# Altium schematic sheet Sheet1_Ren.SchDoc
size 431 x 279 mm; DocumentNumber: 1; SheetNumber: 1; SheetTotal: 1; ENG_APP_DATE: --/--/--; DSN_APP_DATE: --/--/--; CHK_APP_DATE: --/--/--
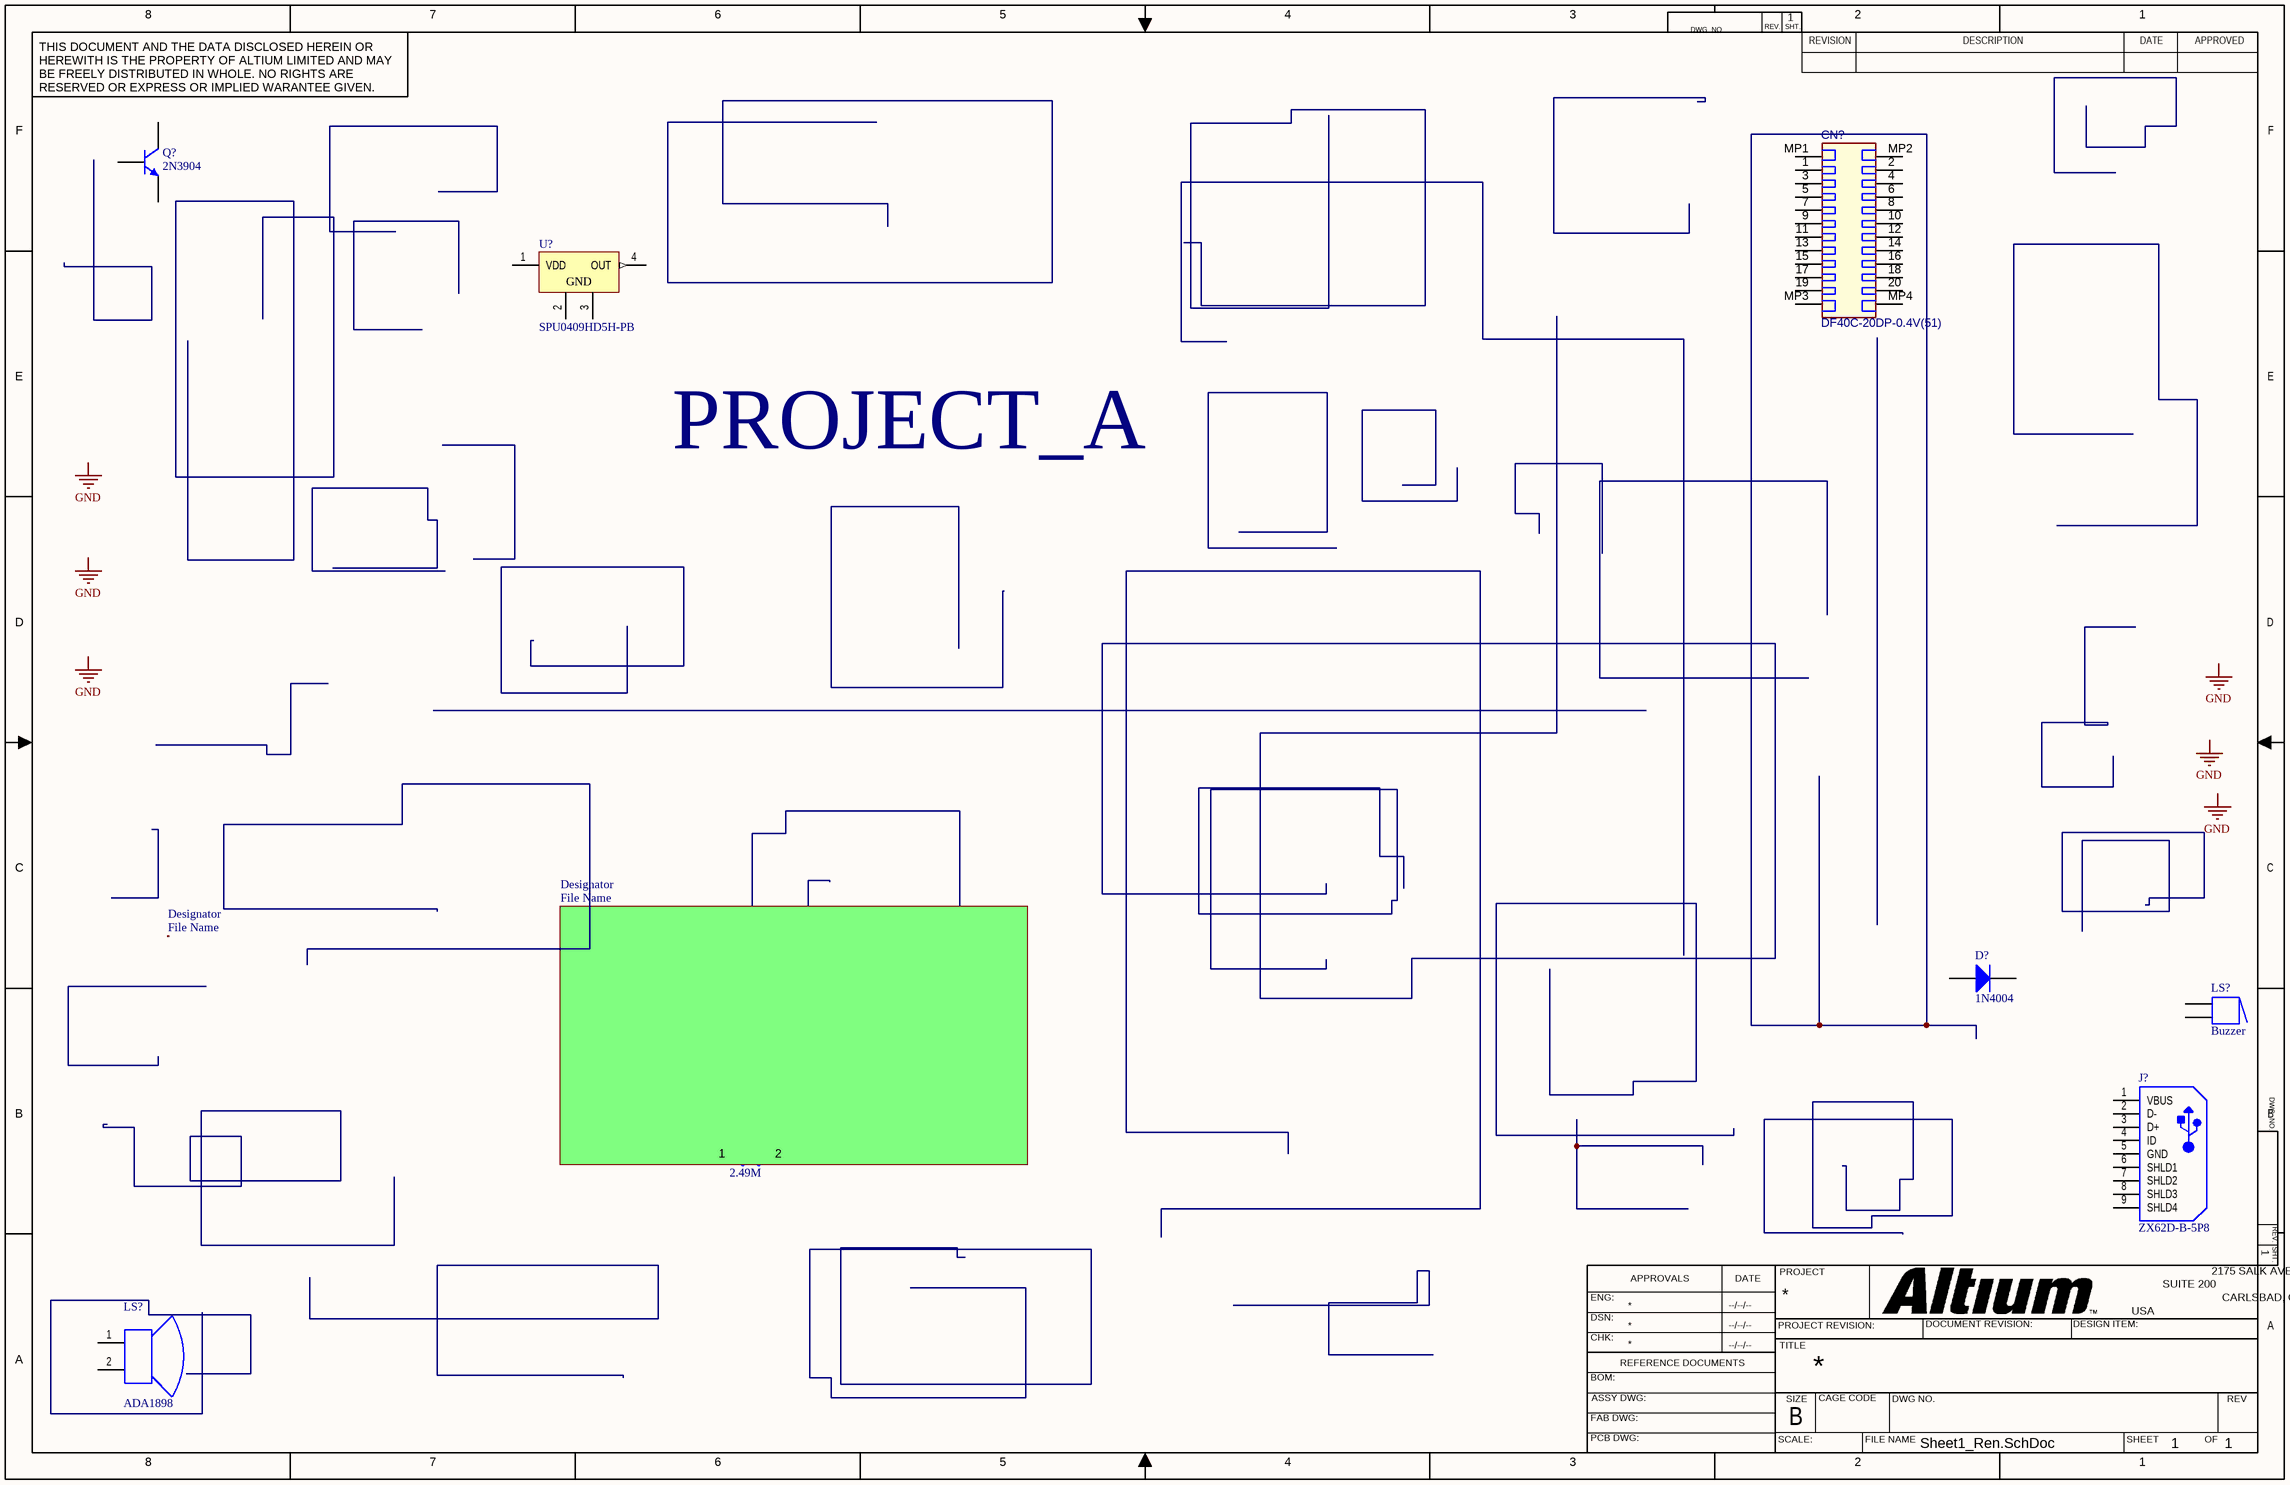
[diagram p0: Sheet1_Ren.SchDoc]

## Parts
(Parts that share a designator on the sheet are numbered #1, #2 ... from top to bottom, then left to right.)
CN?  DF40C-20DP-0.4V(51)  [HIRO-DF40C-20DP-0.4V(51)_V]
D?  1N4004  [FAIR-DO-41-2]
J?  ZX62D-B-5P8  [HIRO-ZX62D-B-5P8_V]
LS?#1  Buzzer  [ABSM-1574]
LS?#2  ADA1898  [ADAI-ADA1898]
Q?  2N3904  [TO-92A]
R?  value 2.49M  [RESC0402(1005)_L]  (hidden comment: Resistor 2M49 +/-1 % 0402 63 mW)
U?  SPU0409HD5H-PB  [KNOW-SPU0409HD5H-PB_V]

## Sub-sheets
Designator = File Name: no entries
Designator = File Name: no entries

## Nets
NetLS?#1_1: LS?#1.1 LS?#1.1A
NetLS?#1_2: LS?#1.2 LS?#1.2A

Not connected (* = marked no-connect by the designer): CN? 1 2 3 4 5 6 7 8 9 10 11 12 13 14 15 16 17 18 19 20 MP1(MP) MP2(MP) MP3(MP) MP4(MP); D? 1(A) 2(K); J? 1(VBUS) 2(D-) 3(D+) 4(ID) 5(GND) 6(SHLD1) 7(SHLD2) 8(SHLD3) 9(SHLD4); LS?#2 1(+) 2(-); Q? 1(E) 2(B) 3(C); R? 1 2; U? 1(VDD) 2(GROUND) 3(GROUND) 4(OUT)

## Notes on the sheet
- PROJECT_A
- Labels drawn without touching a wire or pin: GND
- 8
- 7
- 6
- 5
- 4
- 3
- DWG. NO.
- REV.
- SHT.
- 2
- 1
- THIS DOCUMENT AND THE DATA DISCLOSED HEREIN OR HEREWITH IS THE PROPERTY OF ALTIUM LIMITED AND MAY BE FREELY DISTRIBUTED IN WHOLE. NO RIGHTS ARE RESERVED OR EXPRESS OR IMPLIED WARANTEE GIVEN.
- REVISION
- DESCRIPTION
- DATE
- APPROVED
- F
- E
- D
- C
- B
- ENG:
- APPROVALS
- PROJECT
- SUITE 200
- 2175 SALK AVENUE
- CARLSBAD, CA 92008
- A
- DSN:
- CHK:
- REFERENCE DOCUMENTS
- PROJECT REVISION:
- TITLE
- DOCUMENT REVISION:
- DESIGN ITEM:
- USA
- BOM:
- FAB DWG:
- PCB DWG:
- ASSY DWG:
- SCALE:
- SIZE
- CAGE CODE
- FILE NAME
- DWG NO.
- SHEET
- OF
- REV
- (in symbol CMP-00027-00001-1) GND

## Library data of the parts
CN? = CMP-002-00057-1: Plug Connector, 30 V, 0.3 A, -35 to 85 degC, RoHS, Tape and Reel; Pins: 24
D? = CMP-004-00004-1: General Purpose Rectifier, 400 V, 1 A, -55 to 175 degC, 2-Pin DO-204AL (DO-41), RoHS, Tape and Reel; Manufacturer: Fairchild Semiconductor; Max Surge Current: 30A; Package Version: Rev. 2, 09/2008; Peak Reverse Current: 50A; Forward Voltage: 1.1V; Forward Current: 1A; Manufacturer URL: https://www.fairchildsemi.com/; Mounting Technology: TH; Pins: 2; Max Operating Temperature: 175°C; Packaging: TapeandReel; RoHS Compliant: True; Min Operating Temperature: -55°C; Package URL: http://www.fairchildsemi.com/dwg/DO/DO41A.pdf; Datasheet Version: Rev. 1.1.0, 11/2014; Package Description: 2-Pin Axial Lead, Dia 2.375 mm, Body Length 4.63 mm; Diameter: 2.72mm; Case/Package: DO-41-2; Package Reference: DO-41-2; Package Quantity: 5000; Datasheet URL: https://www.fairchildsemi.com/datasheets/1N/1N4004.pdf
J? = CMP-002-00043-1: Right Angle Receptacle Connector, Micro USB, 5 Position, Height 2.65 mm, -30 to 85 degC, RoHS, Tape and Reel; Manufacturer: Hirose Electric; Current Rating: 1A; Gender: Male; Rows: 1; Min Operating Temperature: -30°C; Packaging: TapeandReel; Contact Material: Copper; Lead Pitch: 0.65mm; Package Quantity: 2000; RoHS Compliant: True; Max Operating Temperature: 85°C; Pins: 5; Datasheet URL: https://www.hirose.com/product/en/download_file/key_name/ZX62D-B-5P8/category/Catalog/doc_file_id/31704/?file_category_id=5&item_id=02420034000&is_series=; Package Description: USB Connector, 5 Position Surface Mount, Length 8 mm, Height 2.65 mm; Mounting Technology: SM; Housing Material: Plastic; Case/Package: ZX62D-B-5P8; Datasheet Version: Aug-16; Connector Type: USB; Manufacturer URL: https://www.hirose.com; Package URL: https://www.hirose.com/product/en/download_file/key_name/ZX62D-B-5P8/category/Drawing%20(2D)/doc_file_id/36535/?file_category_id=6&item_id=02420034000&is_series=; Package Reference: ZX62D-B-5P8; Contact Plating: Gold
LS?#1 = Buzzer: Magnetic Transducer Buzzer; Published: 24-Mar-1999; LatestRevisionDate: 17-Dec-2003; LatestRevisionNote: Schematic revised, PCB Footprint replaced.; DatasheetVersion: 17-Dec-2003; PackageReference: ABSM-1574; Publisher: Altium Limited; PackageDescription: Magnetic Transducer Buzzer; ComponentLink1Description: Manufacturer Link; ComponentLink1URL: http://www.megastar.com/linecard/buzzmode/index.php
LS?#2 = CMP-00027-00000-1: Mini Speaker, 8 Ohm, 0.2 Wmax, -10 to 40 degC, 2-Pin THD, RoHS; Manufacturer: Adafruit Industries; Mounting Technology: TH; Datasheet URL: https://cdn-shop.adafruit.com/datasheets/P1898.pdf; Package Description: 2-Pin Through Hole Device, Dia 29.3 mm, Pitch 15 mm; Case/Package: ADA1898; Package Reference: ADA1898; Datasheet Version: Mar-14; Manufacturer URL: https://www.adafruit.com/; RoHS Compliant: Unknown
Q? = 2N3904: NPN General Purpose Amplifier; Published: 8-Jun-2000; LatestRevisionDate: 15-Jan-2003; LatestRevisionNote: PCB Footprint 'BCY-W3/D4.7' replaced; DatasheetVersion: 1997; PackageVersion: Sep-1998; PackageReference: TO-92A; Publisher: Altium Limited; PackageDescription: TO, Flat Index; 3 In-Line, Axial Leads; Body Dia. 4.5mm; Leads 0.51 x 0.48 mm (max); ComponentLink1Description: Manufacturer Link; ComponentLink1URL: http://www.fairchildsemi.com/; ComponentLink2Description: Datasheet; ComponentLink2URL: http://www.fairchildsemi.com/ds/2N%2F2N3904.pdf
R? = CMP-009-00169-2: Chip Resistor, 2,49 MOhms, +/-1 %, 63 mW, -55 to 155 degC, 0402; Tolerance: 1%; Power: 63mW; Case/Package: 0402; Max Operating Temperature: 155°C; Min Operating Temperature: -55°C; Pins: 2
U? = CMP-00027-00001-1: SiSonic(TM) Microphone, 1.5 to 3.6 V, -40 to 100 degC, 4-Pin SMD, RoHS, Tape and Reel; Manufacturer: Knowles Acoustics; Voltage Rating: 3.6V; Impedance: 100Ohm; Package Quantity: 1200; RoHS Compliant: True; Manufacturer URL: http://www.knowles.com/; Datasheet URL: http://datasheet.octopart.com/SPU0409HD5H-PB-Knowles-Acoustics-datasheet-17019172.pdf; Package Reference: SPU0409HD5H-PB; Case/Package: SPU0409HD5H-PB; Mounting Technology: SM; Packaging: TapeandReel; Package Description: 4-Pin Surface Mount Device, Body 3.76 x 2.95 mm; Datasheet Version: Rev. F, 03/2013